# Altium schematic sheet Analog Circuitry.SchDoc
size A4; SheetNumber: 2; SheetTotal: 6
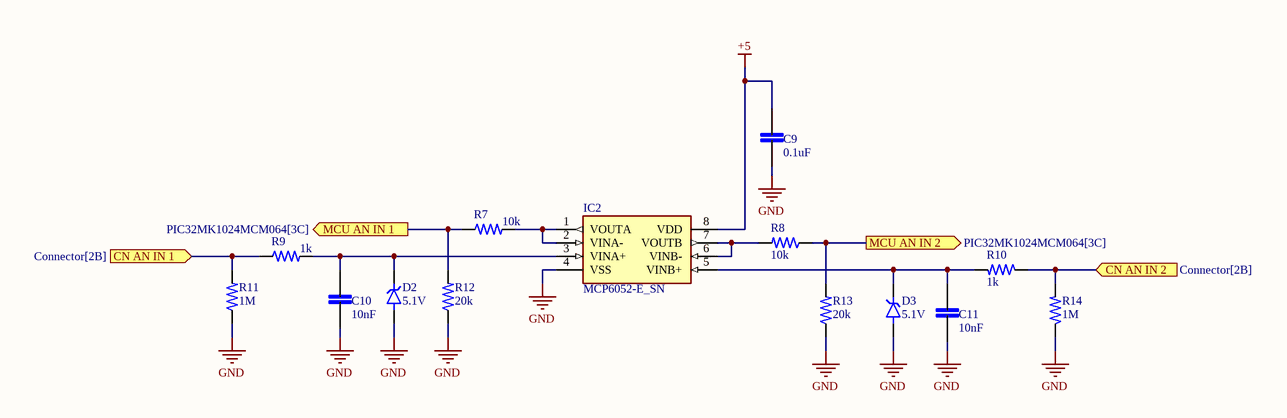
[diagram p0: Analog Circuitry.SchDoc]

## Parts
C9  0.1uF  [0805]
C10  10nF  [0805]
C11  10nF  [0805]
D2  5.1V  [SOD323]
D3  5.1V  [SOD323]
IC2  MCP6052-E_SN  [MCP6052-E_SN]
R7  10k  [0805]
R8  10k  [0805]
R9  1k  [0805]
R10  1k  [0805]
R11  1M  [0805]
R12  20k  [0805]
R13  20k  [0805]
R14  1M  [0805]

## Ports
CN AN IN 1 (in, see Connector[2B]), CN AN IN 2 (in, see Connector[2B]), MCU AN IN 1 (out, see PIC32MK1024MCM064[3C]), MCU AN IN 2 (out, see PIC32MK1024MCM064[3C])

## Nets
+5: C9.2 IC2.8(VDD)
GND: C9.1 C10.1 C11.1 D2.2(A) D3.2(A) IC2.4(VSS) R11.1 R12.1 R13.1 R14.1
CN AN IN 1: R9.1 R11.2 ; port CN AN IN 1
CN AN IN 2: R10.1 R14.2 ; port CN AN IN 2
MCU AN IN 1: R7.1 R12.2 ; port MCU AN IN 1
MCU AN IN 2: R8.1 R13.2 ; port MCU AN IN 2
NetC10_2: C10.2 D2.1(K) IC2.3(VINA+) R9.2
NetC11_2: C11.2 D3.1(K) IC2.5(VINB+) R10.2
NetIC2_1: IC2.1(VOUTA) IC2.2(VINA-) R7.2
NetIC2_6: IC2.6(VINB-) IC2.7(VOUTB) R8.2

## Library data of the parts
C9-C11 = 0805_Capacitor: MP: LD051A121KAB2A; MF: AVX; SnapEDA_Link: https://www.snapeda.com/parts/LD051A121KAB2A/AVX/view-part/?ref=snap; Package: 0805 AVX; Check_prices: https://www.snapeda.com/parts/LD051A121KAB2A/AVX/view-part/?ref=eda; Purchase-URL: https://pricing.snapeda.com/search/part/LD051A121KAB2A/?ref=eda; Price: None; Value: *; Availability: In Stock
D2 D3 = SOD323 - Zener Diode: MP: 1SMA5926; MF: Taiwan Semiconductor; Package: SMA-2 Taiwan Semiconductor; Availability: In Stock; Purchase-URL: https://pricing.snapeda.com/search/part/1SMA5926/?ref=eda; SnapEDA_Link: https://www.snapeda.com/parts/1SMA5926/Taiwan+Semiconductor/view-part/?ref=snap; Price: None; Check_prices: https://www.snapeda.com/parts/1SMA5926/Taiwan+Semiconductor/view-part/?ref=eda; Value: *
IC2 = MCP6052-E_SN: Integrated Circuit; Manufacturer_Name: Microchip; Manufacturer_Part_Number: MCP6052-E/SN; Datasheet Link: http://ww1.microchip.com/downloads/en/DeviceDoc/MCP6051_DS22182B.pdf; Height: 1.75mm; Mouser Part Number: 579-MCP6052-E/SN; Mouser Price/Stock: https://www.mouser.com/Search/Refine.aspx?Keyword=579-MCP6052-E%2FSN
R7-R14 = 0805_Resistor: Power_Rating: .25 W; MP: 2-2176053-0; Tolerance: 1%; Resistance: .33; MF: TE Connectivity; Price: None; Availability: In Stock; EU_RoHS_Compliance: Compliant with Exemptions; Package: 0805; Value: *; SnapEDA_Link: https://www.snapeda.com/parts/2-2176053-0/TE+Connectivity/view-part/?ref=snap; Check_prices: https://www.snapeda.com/parts/2-2176053-0/TE+Connectivity/view-part/?ref=eda